# EAGLE schematic BATT_DCDC_TEST_BED (EAGLE 9.6.2)
COMPANY: ADAFRUIT INDUSTRIES; DRAWN: KTOWN; REV: B
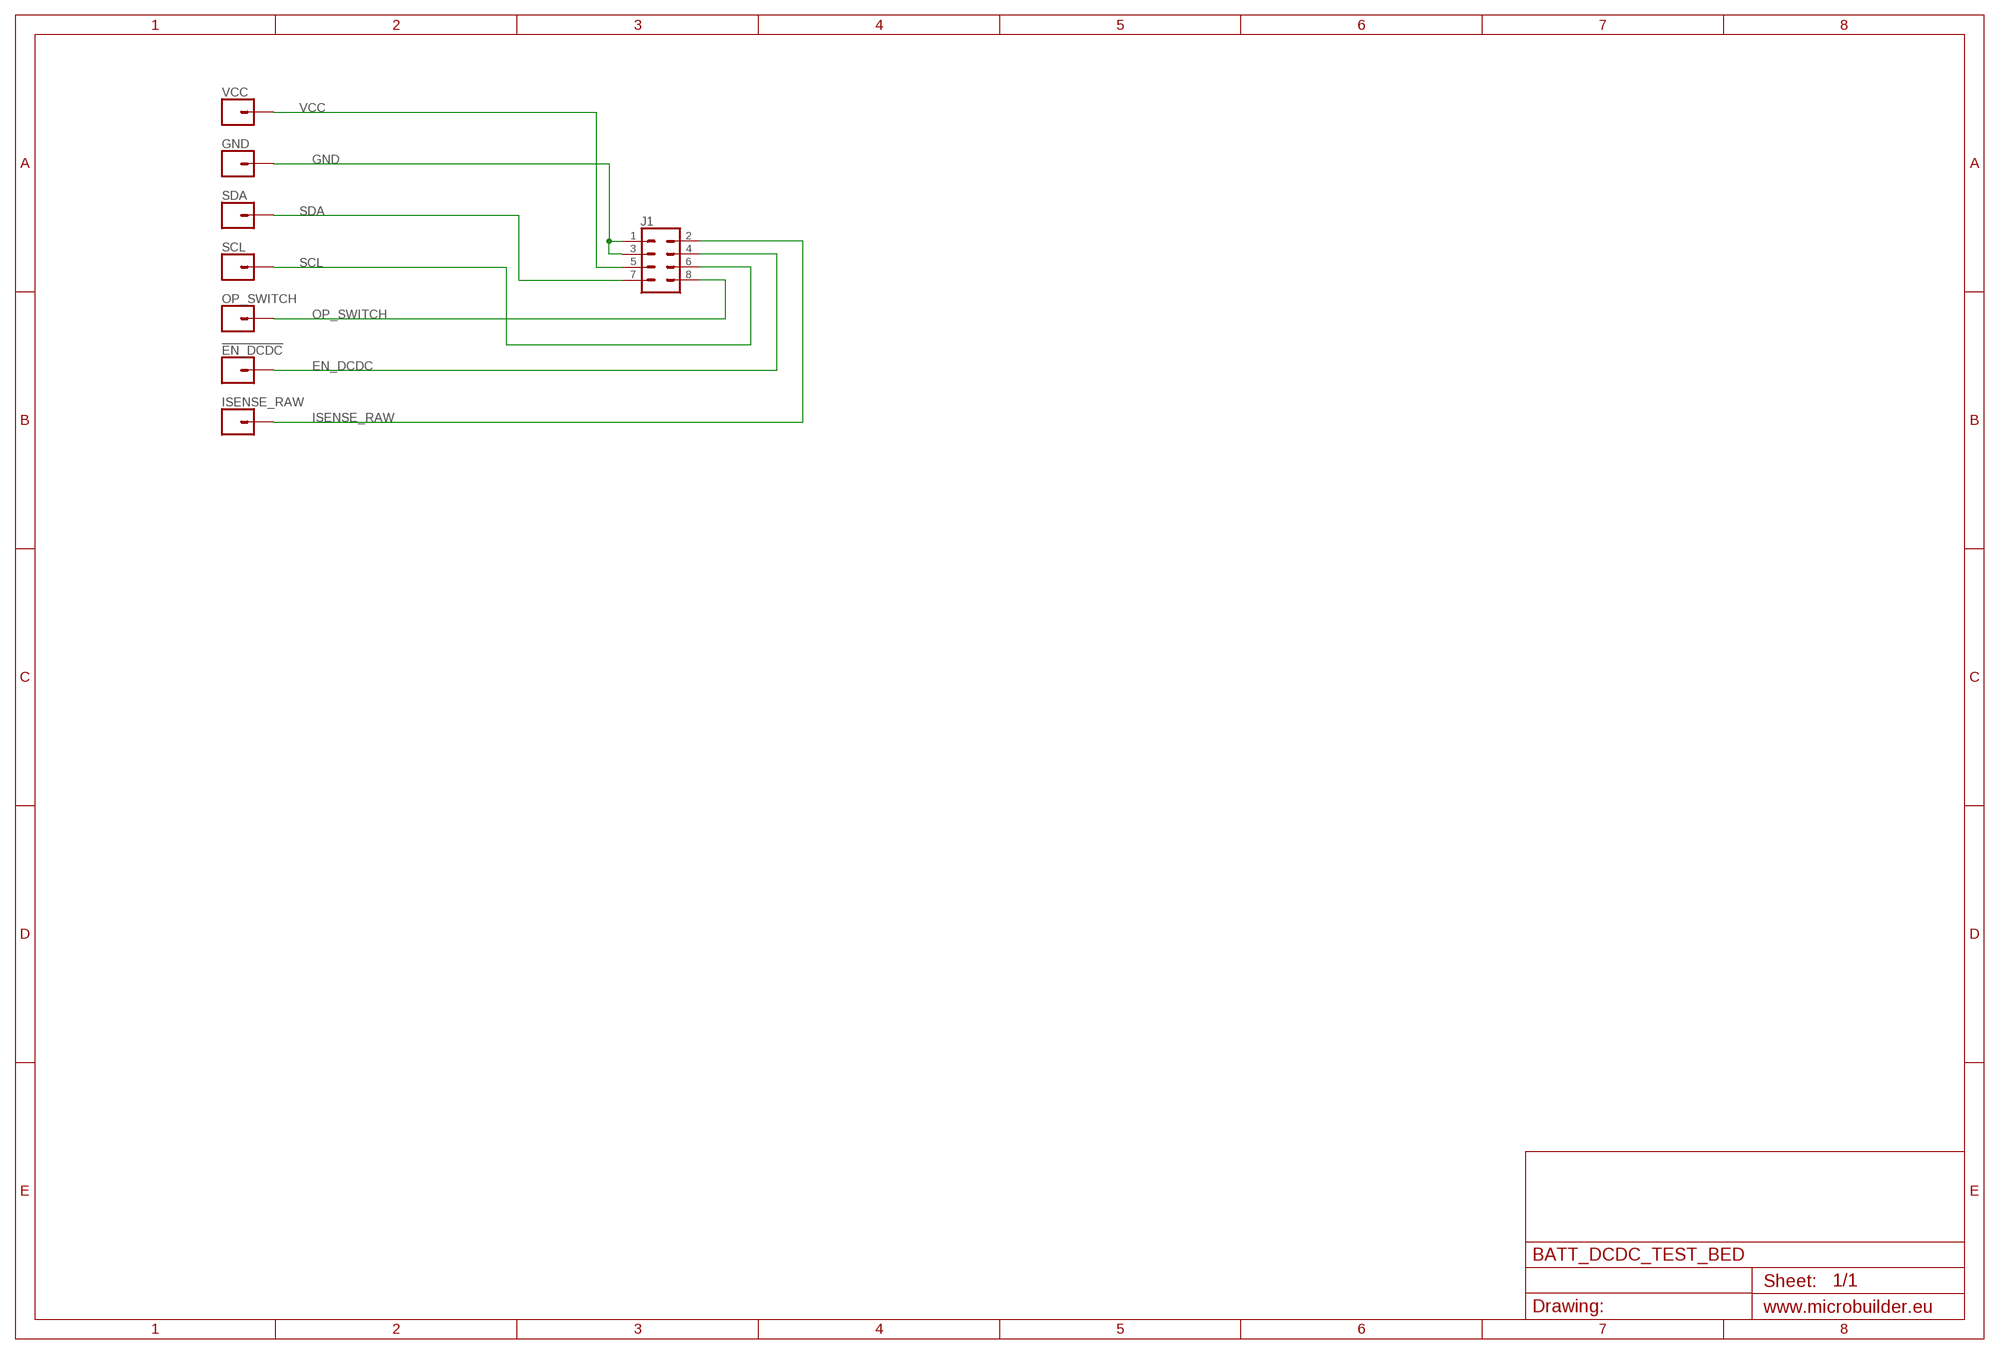
[diagram p0: schematic, sheet 1]

## Parts
!EN_DCDC!  CONN_01POGOPIN_HOLE_LARGE  [1X01_POGOPIN_HOLE_0.061_DIA]
GND  CONN_01POGOPIN_HOLE_LARGE  [1X01_POGOPIN_HOLE_0.061_DIA]
ISENSE_RAW  CONN_01POGOPIN_HOLE_LARGE  [1X01_POGOPIN_HOLE_0.061_DIA]
J1  CONN_04X2  [2X4]
OP_SWITCH  CONN_01POGOPIN_HOLE_LARGE  [1X01_POGOPIN_HOLE_0.061_DIA]
SCL  CONN_01POGOPIN_HOLE_LARGE  [1X01_POGOPIN_HOLE_0.061_DIA]
SDA  CONN_01POGOPIN_HOLE_LARGE  [1X01_POGOPIN_HOLE_0.061_DIA]
VCC  CONN_01POGOPIN_HOLE_LARGE  [1X01_POGOPIN_HOLE_0.061_DIA]

## Nets
EN_DCDC: !EN_DCDC!.2 J1.4
GND: GND.2 J1.1 J1.3
ISENSE_RAW: ISENSE_RAW.2 J1.2
OP_SWITCH: J1.8 OP_SWITCH.2
SCL: J1.6 SCL.2
SDA: J1.7 SDA.2
VCC: J1.5 VCC.2

## Library data of the parts
!EN_DCDC! GND ISENSE_RAW OP_SWITCH SCL SDA VCC = SparkFun-Connectors:CONN_01: Single connection point. Often used as Generic Header-pin footprint for 0.1 inch spaced/style header connections On any of the 0.1 inch spaced packages, you can populate with these: Break Away Headers - Straight <https://www.sparkfun.com/products/116> (PRT-00116) Break Away Male Headers - Right Angle <https://www.sparkfun.com/products/553> (PRT-00553) Female Headers <https://www.sparkfun.com/products/115> (PRT-00115) Break Away Headers - Machine Pin <https://www.sparkfun.com/products/117> (PRT-00117) Break Away Female Headers - Swiss Machine Pin <https://www.sparkfun.com/products/743> (PRT-00743) This device is also useful as a general connection point to wire up your design to another part of your project. Our various solder wires solder well into these plated through hole pads. Hook-Up Wire - Assortment (Stranded, 22 AWG) <https://www.sparkfun.com/products/11375> (PRT-11375) Hook-Up Wire - Assortment (Solid Core, 22 AWG) <https://www.sparkfun.com/products/11367> (PRT-11367) View the entire wire category on our website here <https://www.sparkfun.com/categories/141> Special notes: SMTSO-256-ET is a "flush mount" nut for a 4-40 screw. We mostly use this on specialty testbeds; it is a nice way to connect hardware to your PCB at an adjustable hieght. Also note, the SNAP packages are for using a snappable style connector. We sell a baggie of snaps and they are also used on two LilyPad designs: Snap Assortment - 30 pack (male and female) <https://www.sparkfun.com/products/11347> (DEV-11347) LilyPad Arduino SimpleSnap <https://www.sparkfun.com/products/10941> (DEV-10941) LilyPad SimpleSnap Protoboard <https://www.sparkfun.com/products/10940> (DEV-10940)
J1 = SparkFun-Connectors:CONN_04X2: Multi connection point. Often used as Generic Header-pin footprint for 0.1 inch spaced/style header connections On any of the 0.1 inch spaced packages, you can populate with these: Break Away Headers - Straight <https://www.sparkfun.com/products/116> (PRT-00116) Break Away Male Headers - Right Angle <https://www.sparkfun.com/products/553> (PRT-00553) Female Headers <https://www.sparkfun.com/products/115> (PRT-00115) Break Away Headers - Machine Pin <https://www.sparkfun.com/products/117> (PRT-00117) Break Away Female Headers - Swiss Machine Pin <https://www.sparkfun.com/products/743> (PRT-00743)

## Net classes
2 gnd: width 0.305 mm, drill 0.483 mm, clearance 0.203 mm